# Altium schematic sheet [02] CPU 1214c.SchDoc
size A4
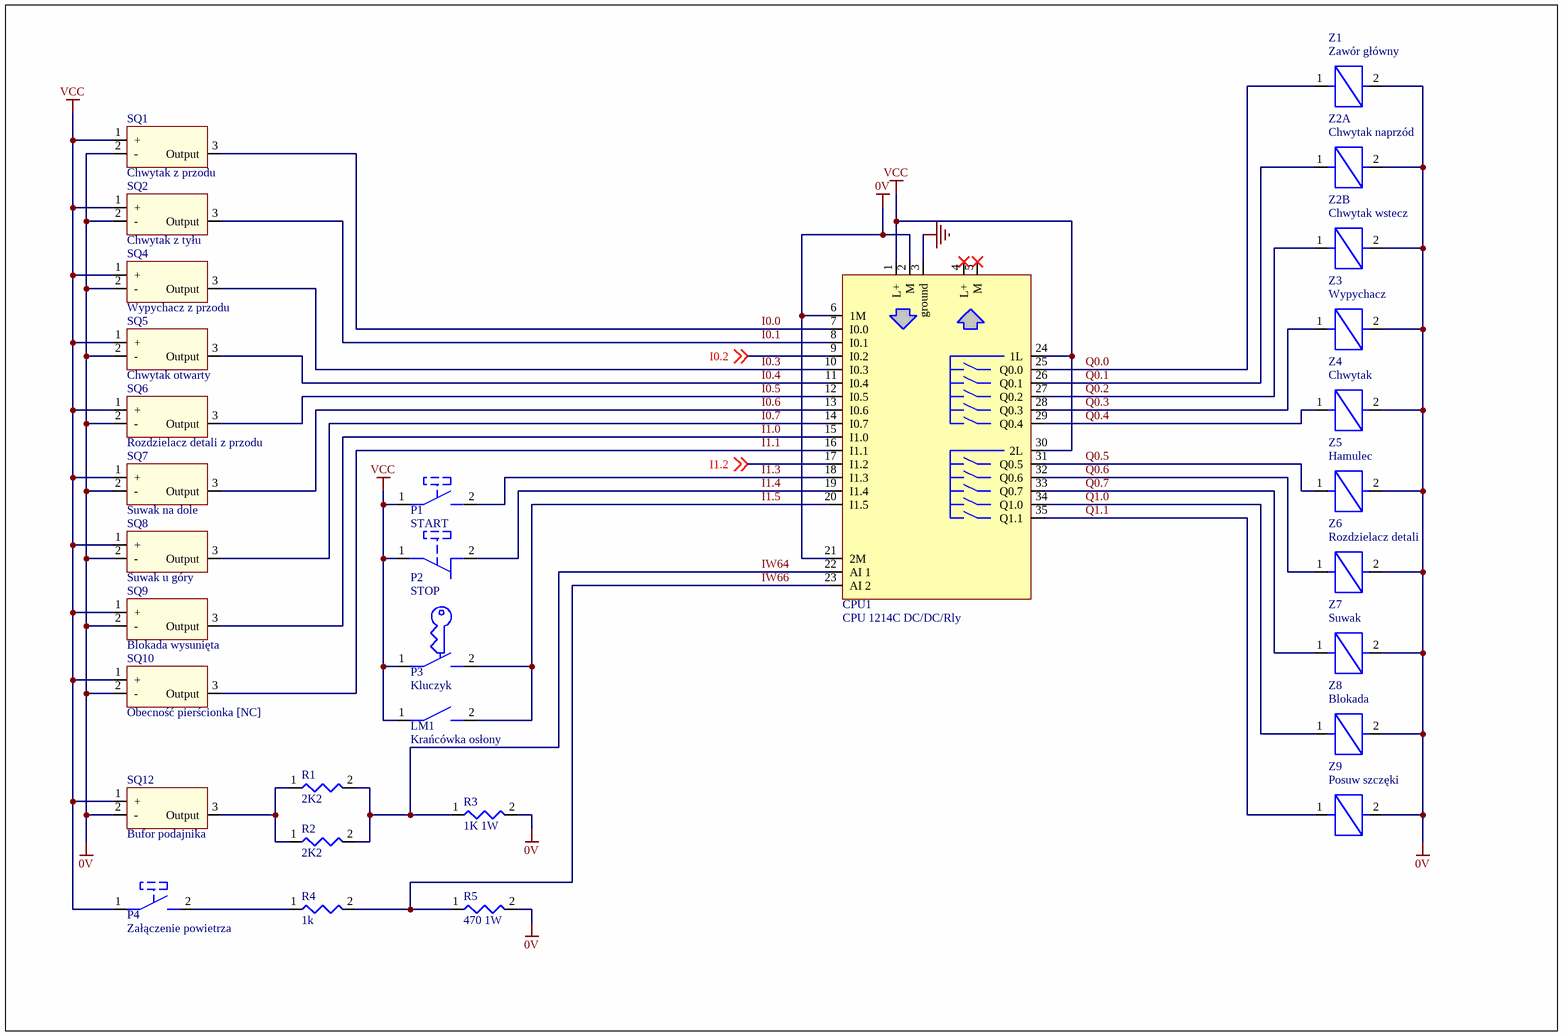
[diagram p0: [02] CPU 1214c.SchDoc]

## Parts
CPU1  CPU 1214C DC/DC/Rly
LM1  Krańcówka osłony
P1  START
P2  STOP
P3  Kluczyk
P4  Załączenie powietrza
R1  2K2
R2  2K2
R3  1K 1W
R4  1k
R5  470 1W
SQ1  Chwytak z przodu
SQ2  Chwytak z tyłu
SQ4  Wypychacz z przodu
SQ5  Chwytak otwarty
SQ6  Rozdzielacz detali z przodu
SQ7  Suwak na dole
SQ8  Suwak u góry
SQ9  Blokada wysunięta
SQ10  Obecność pierścionka [NC]
SQ12  Bufor podajnika
Z1  Zawór główny
Z2A  Chwytak naprzód
Z2B  Chwytak wstecz
Z3  Wypychacz
Z4  Chwytak
Z5  Hamulec
Z6  Rozdzielacz detali
Z7  Suwak
Z8  Blokada
Z9  Posuw szczęki

## Nets
0V: CPU1.2(M) CPU1.6(1M) CPU1.21(2M) R3.2 R5.2 SQ1.2(-) SQ2.2(-) SQ4.2(-) SQ5.2(-) SQ6.2(-) SQ7.2(-) SQ8.2(-) SQ9.2(-) SQ10.2(-) SQ12.2(-) Z1.2 Z2A.2 Z2B.2 Z3.2 Z4.2 Z5.2 Z6.2 Z7.2 Z8.2 Z9.2
GND: CPU1.3(ground)
VCC: CPU1.1(L+) CPU1.24(1L) CPU1.30(2L) LM1.1 P1.1 P2.1 P3.1 P4.1 SQ1.1(+) SQ2.1(+) SQ4.1(+) SQ5.1(+) SQ6.1(+) SQ7.1(+) SQ8.1(+) SQ9.1(+) SQ10.1(+) SQ12.1(+)
I0.0: CPU1.7(I0.0) SQ1.3(Output)
I0.1: CPU1.8(I0.1) SQ2.3(Output)
I0.2: CPU1.9(I0.2) ; off-sheet I0.2
I0.3: CPU1.10(I0.3) SQ4.3(Output)
I0.4: CPU1.11(I0.4) SQ5.3(Output)
I0.5: CPU1.12(I0.5) SQ6.3(Output)
I0.6: CPU1.13(I0.6) SQ7.3(Output)
I0.7: CPU1.14(I0.7) SQ8.3(Output)
I1.0: CPU1.15(I1.0) SQ9.3(Output)
I1.1: CPU1.16(I1.1) SQ10.3(Output)
I1.2: CPU1.17(I1.2) ; off-sheet I1.2
I1.3: CPU1.18(I1.3) P1.2
I1.4: CPU1.19(I1.4) P2.2
I1.5: CPU1.20(I1.5) LM1.2 P3.2
IW64: CPU1.22(AI_1) R1.2 R2.2 R3.1
IW66: CPU1.23(AI_2) R4.2 R5.1
Q0.0: CPU1.25(Q0.0) Z1.1
Q0.1: CPU1.26(Q0.1) Z2A.1
Q0.2: CPU1.27(Q0.2) Z2B.1
Q0.3: CPU1.28(Q0.3) Z3.1
Q0.4: CPU1.29(Q0.4) Z4.1
Q0.5: CPU1.31(Q0.5) Z5.1
Q0.6: CPU1.32(Q0.6) Z6.1
Q0.7: CPU1.33(Q0.7) Z7.1
Q1.0: CPU1.34(Q1.0) Z8.1
Q1.1: CPU1.35(Q1.1) Z9.1
NetP4_2: P4.2 R4.1
NetR1_1: R1.1 R2.1 SQ12.3(Output)

Not connected (* = marked no-connect by the designer): CPU1 4(L+)* 5(M)*

## Library data of the parts
LM1 = NO
P1 P4 = Button NO
P2 = Button NC
P3 = Key switch 1 line
R1-R5 = Resistor
SQ1 SQ2 SQ4-SQ10 SQ12 = Magnetic sensor PNP
Z1 Z2A Z2B Z3-Z9 = Coil